# EAGLE design OpenDTU_USB (EAGLE 9.6.2)
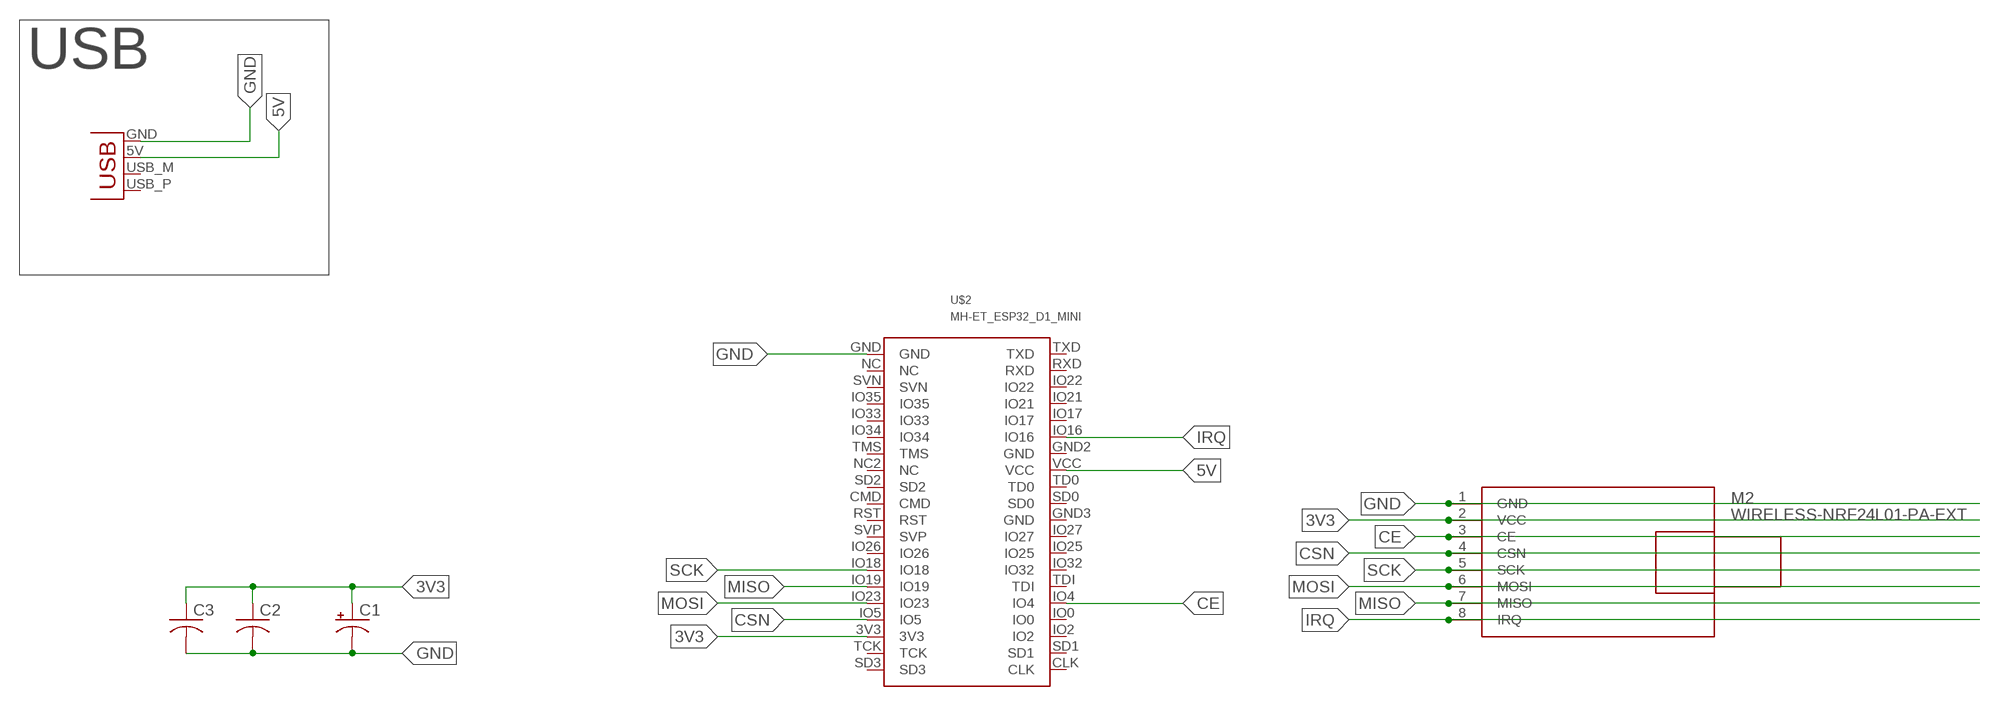
[diagram p0: schematic, sheet 1]

## Parts
C1  CPOL-USE2.5-6  [E2,5-6]
C2  C-USC0805K  [C0805K]
C3  C-USC0805K  [C0805K]
M2  WIRELESS-NRF24L01-PA-EXT  [WIRELESS-NRF24L01-PA-EXT]
U$2  MH-ET_ESP32_D1_MINI  [MH-ET_ESP32_D1_MINI]
X1  USBPCB  [USB-A-PCB]

## Nets
3V3: C1.+ C2.1 C3.1 M2.2(VCC) U$2.3V3
5V: U$2.VCC X1.5V(VBUS)
CE: M2.3(CE) U$2.IO4
CSN: M2.4(CSN) U$2.IO5
GND: C1.- C2.2 C3.2 M2.1(GND) U$2.GND X1.GND
IRQ: M2.8(IRQ) U$2.IO16
MISO: M2.7(MISO) U$2.IO19
MOSI: M2.6(MOSI) U$2.IO23
SCK: M2.5(SCK) U$2.IO18
Unconnected: U$2.CLK U$2.CMD U$2.GND2(GND) U$2.GND3(GND) U$2.IO0 U$2.IO2 U$2.IO17 U$2.IO21 U$2.IO22 U$2.IO25 U$2.IO26 U$2.IO27 U$2.IO32 U$2.IO33 U$2.IO34 U$2.IO35 U$2.NC U$2.NC2(NC) U$2.RST U$2.RXD U$2.SD0 U$2.SD1 U$2.SD2 U$2.SD3 U$2.SVN U$2.SVP U$2.TCK U$2.TD0 U$2.TDI U$2.TMS U$2.TXD X1.USB_M(D-) X1.USB_P(D+)

## Notes on the sheet
- USB

## Library data of the parts
C1 = adafruit:CPOL-US: POLARIZED CAPACITOR, American symbol
C2 C3 = adafruit:C-US: CAPACITOR, American symbol
M2 = diy-modules:WIRELESS-NRF24L01-PA-EXT: 2.4 GHz Wireless Module based on NRF24L01 chip with preamplifier and external antenna Click here to find device on ebay.com <http://www.ebay.com/sch/nrf24l01+pa+lna+sma>
U$2 = MH-ET_ESP32_D1_MINI:MH-ET_ESP32_D1_MINI
X1 = SparkFun_Old:USB: USB Connectors USB-B-PTH is fully proven SKU : PRT-00139 USB-miniB is fully proven SKU : PRT-00587 USB-A-PCB is untested. USB-A-H is throughly reviewed, but untested. Spark Fun Electronics SKU : PRT-00437 USB-B-SMT is throughly reviewed, but untested. Needs silkscreen touching up. USB-A-S has not been used/tested USB-MB-H has not been used/tested

## Board
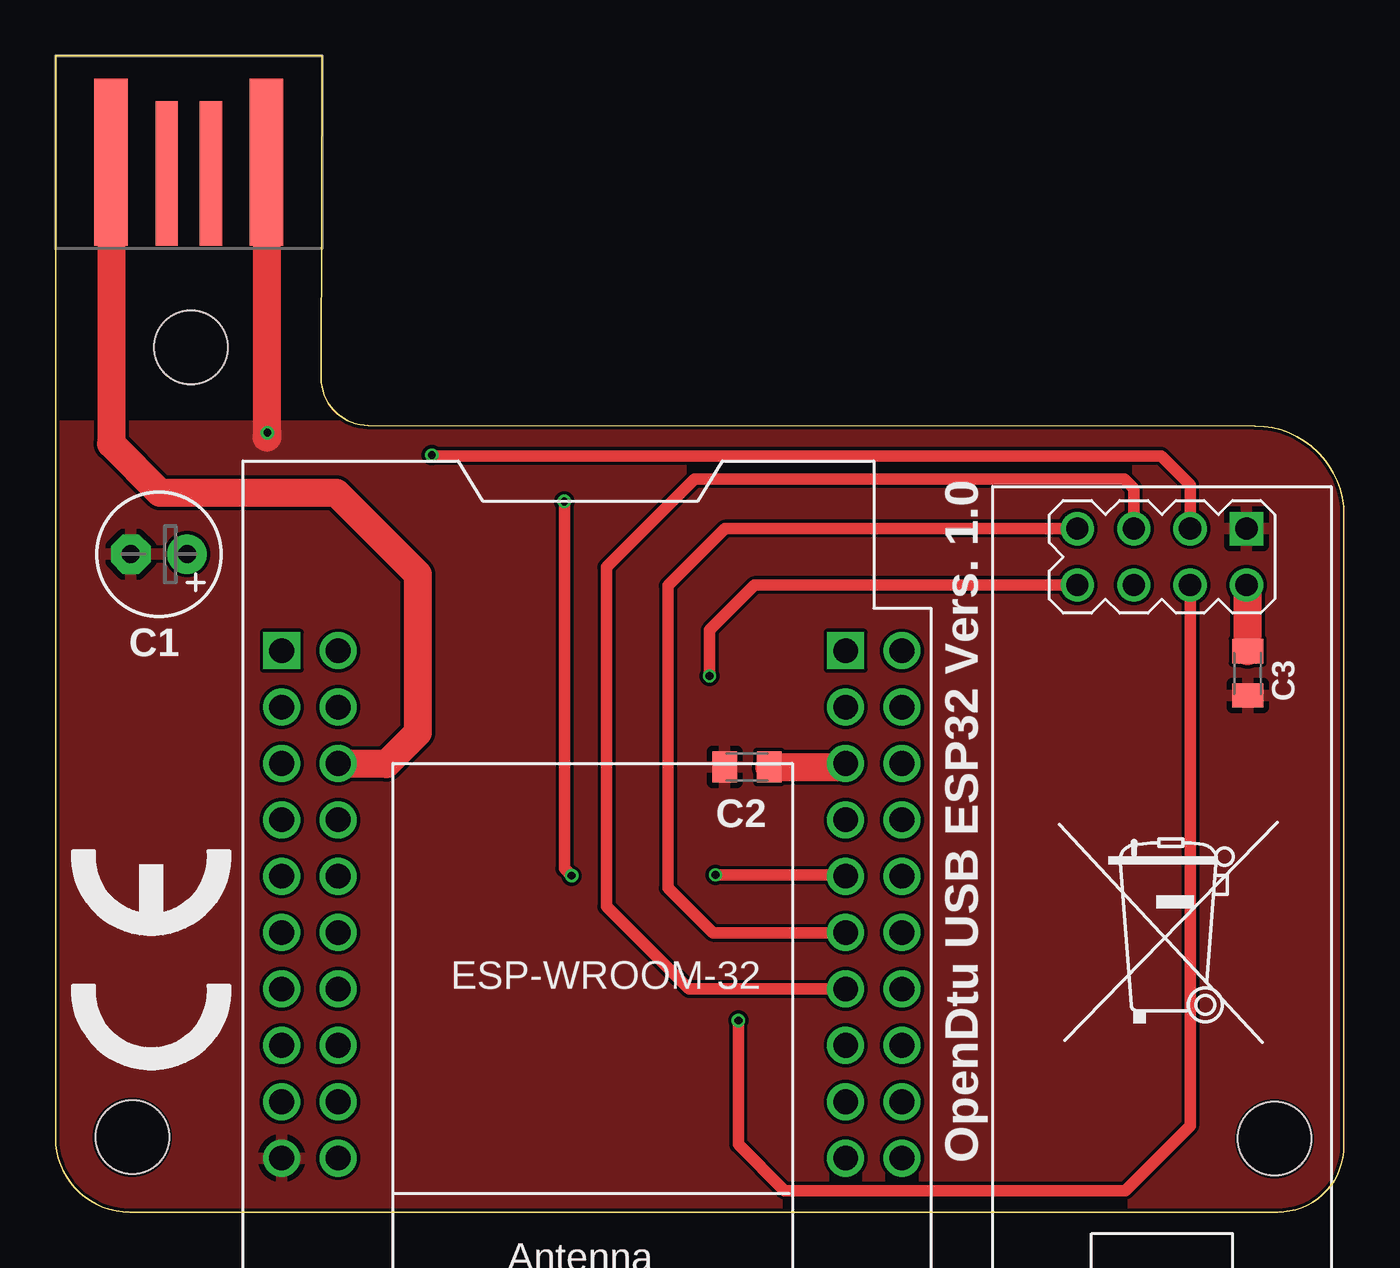
[diagram p1: board, top side]
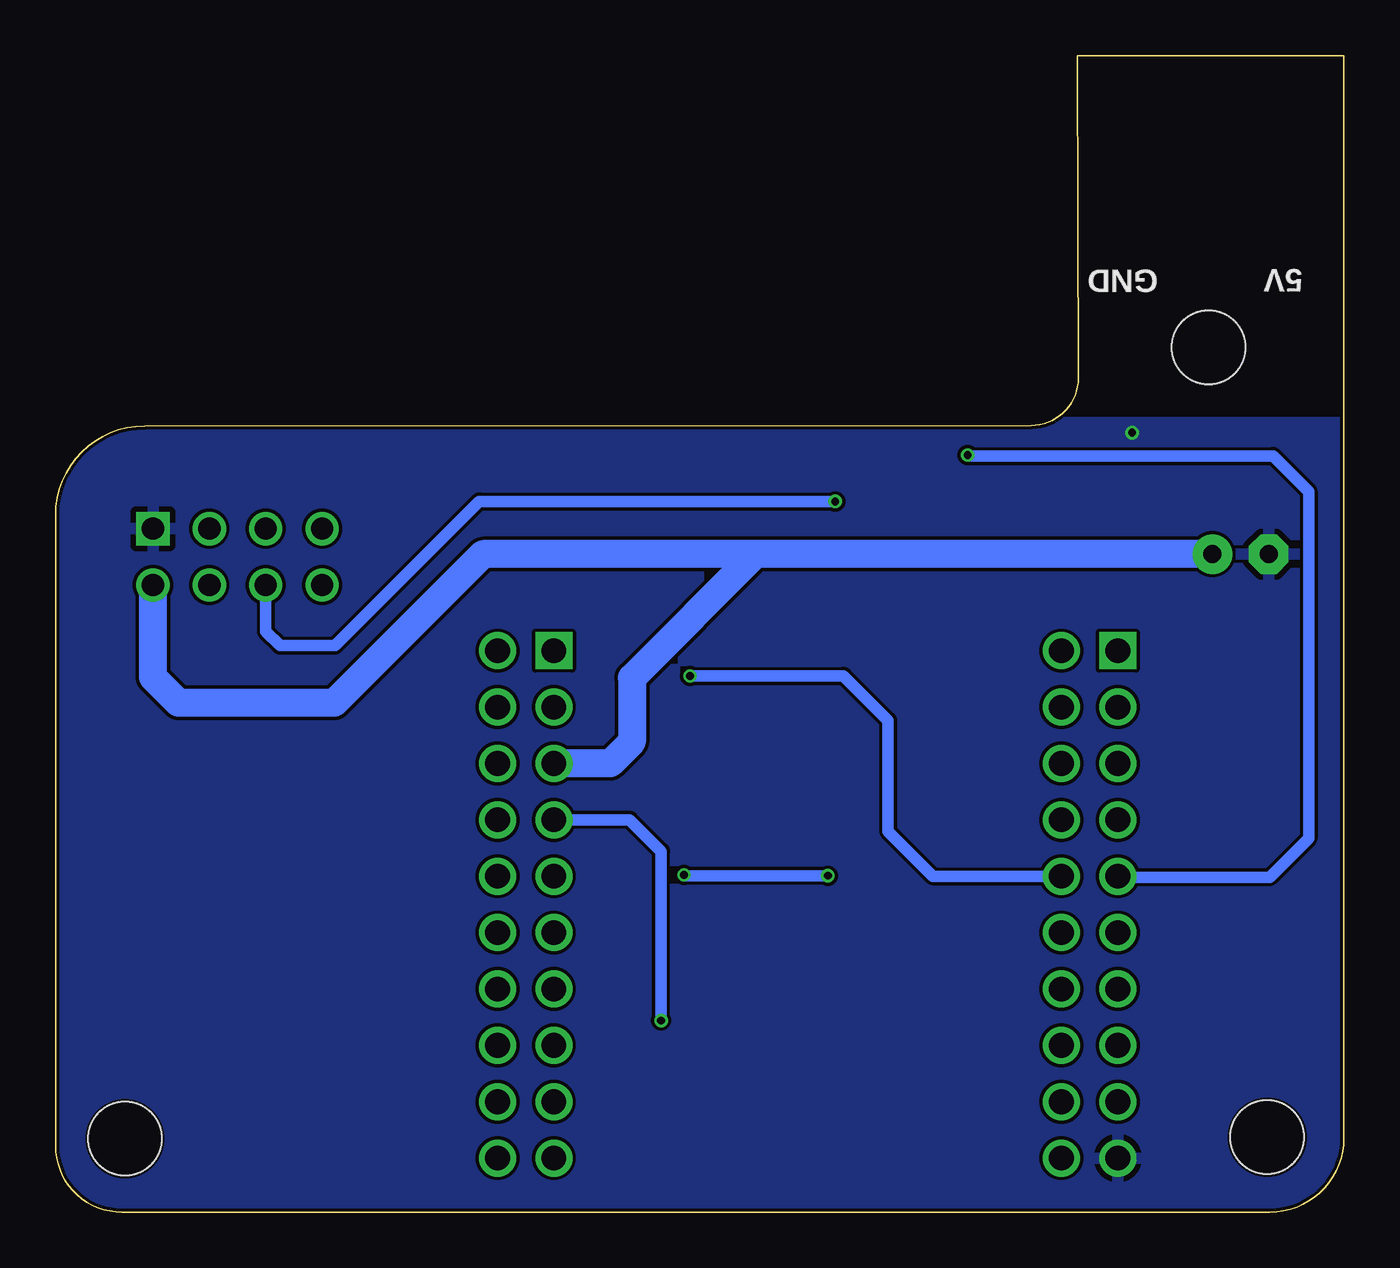
[diagram p2: board, bottom side, seen from below]

Size 58.04 x 52.1 mm. Coordinates in mm from the lower left corner, seen from the top.
Outline: 0,52.1 0,3.34 arc90 3.34,0 55.05,0 arc90 58.04,2.99 58.04,31.4 arc90 54.03,35.41 14.09,35.44 arc-90 11.97,37.57 12.02,52.1 0,52.1
Copper layers (1*16): Top 0.035559375mm / dielectric 1.6mm / Bottom 0.035559375mm
Design rules "oshpark-2layer *": minimum track width 6mil, minimum drill 10mil, track to track 6mil, track to pad 6mil, pad to pad 6mil, via to via 6mil, smd to smd 6mil, copper to edge 5mil, drill to drill 6mil, minimum pad ring 5mil, minimum via ring 5mil, stop-mask expansion 2.5mil, vias tented up to drill 0mil, thermal gap 10mil
Holes 3.3 mm at 6.09,38.96 3.46,3.37 54.91,3.31

### Footprints (pad centres in the part's own frame; a part is rotated, then mirrored left to right if it is on the bottom)
E2,5-6 = drill 0.813 pad 1.778: + -1.27,0 | drill 0.813 pad 1.778 octagon: - 1.27,0
C0805K = smd 1.1 x 1.4: 1 -1,0; 2 1,0
WIRELESS-NRF24L01-PA-EXT = drill 1 square: 1 -18.415,3.81 | drill 1: 2 -15.875,3.81; 3 -18.415,1.27; 4 -15.875,1.27; 5 -18.415,-1.27; 6 -15.875,-1.27; 7 -18.415,-3.81; 8 -15.875,-3.81
MH-ET_ESP32_D1_MINI = drill 1.11 pad 1.665: 3V3 25.4,-5.08; CMD 27.94,0; GND 0,-22.86; GND2 2.54,-7.62; GND3 27.94,-22.86; IO0 0,-7.62; IO2 0,-5.08; IO4 0,-10.16; IO5 25.4,-7.62; IO16 2.54,-10.16; IO17 2.54,-12.7; IO18 25.4,-15.24; IO19 25.4,-12.7; IO21 2.54,-15.24; IO22 2.54,-17.78; IO23 25.4,-10.16; IO25 0,-17.78; IO26 25.4,-17.78; IO27 0,-20.32; IO32 0,-15.24; IO33 27.94,-12.7; IO34 27.94,-10.16; IO35 27.94,-15.24; NC 27.94,-20.32; NC2 27.94,-5.08; RST 25.4,-22.86; RXD 2.54,-20.32; SD0 2.54,0; SD1 0,-2.54; SD2 27.94,-2.54; SVN 27.94,-17.78; SVP 25.4,-20.32; TCK 25.4,-2.54; TD0 2.54,-2.54; TDI 0,-12.7; TMS 27.94,-7.62; TXD 2.54,-22.86; VCC 2.54,-5.08 | drill 1.11 pad 1.665 square: CLK 0,0; SD3 25.4,0
USB-A-PCB = smd 7.5 x 1.5: 5V -0.2,-3.5; GND -0.2,3.5 | smd 6.5 x 1: USB_M 0.3,-1; USB_P 0.3,1

### Placement (x,y rotation side)
C1  4.66,29.64 180 top
C2  31.14,20.05 180 top
C3  53.7,24.27 270 top
M2  49.84,12.37 270 top
U$1  [CE_7.3MM]  7.95,6.33 90 top
U$2  10.19,25.29 0 top
U$3  [MUELLTONNE_10.00]  44.55,7.24 0 top
X1  6,47.1 270 top

### Tracks (layer width: path | path; a pad name or v marks a point on that pad's centre or on a via)
3V3
  Top 1.27: C2.1 35.43,20.05 U$2.3V3 | C3.1 53.7,28.19 M2.2
  Bottom 1.27: C1.+ 26.51,29.64 | 26.51,29.64 32.08,24.07 32.08,21.18 33.05,20.21 U$2.3V3 | 26.51,29.64 38.78,29.64 45.48,22.94 52.5,22.94 53.65,24.09 M2.2
5V
  Top 1.27: X1.5V 2.5,34.61 4.7,32.41 12.65,32.41 16.32,28.74 16.32,21.59 14.91,20.18 12.76,20.18 U$2.VCC
CE  (via drill 0.35)
  Top 0.508: M2.3 51.11,32.76 49.81,34.06 16.99,34.06 v16.95,34.1
  Bottom 0.508: v16.95,34.1 16.91,34.06 3.19,34.06 1.59,32.46 1.59,16.84 3.35,15.08 10.14,15.08 U$2.IO4
CSN  (via drill 0.35)
  Top 0.508: M2.4 51.11,3.88 48.2,0.97 32.84,0.97 30.76,3.05 v30.76,8.63
  Bottom 0.508: v30.76,8.63 30.76,16.25 32.18,17.67 U$2.IO5
GND  (via drill 0.35)
  Top 1.27: X1.GND 9.5,34.89 9.55,34.89 v9.55,35.11
  pour Top: 13.99,35.41 0.07,35.41 0.07,0.29 57.99,0.29 57.99,35.45 13.99,35.45
  pour Bottom: 0.15,35.57 58.2,35.57 58.2,0.14 0.15,0.14
IRQ  (via drill 0.35)
  Top 0.508: M2.8 31.48,28.25 29.46,26.22 v29.46,24.15
  Bottom 0.508: v29.46,24.15 22.54,24.15 20.54,22.15 20.54,17.15 18.52,15.13 U$2.IO16
MISO
  Top 0.508: M2.7 30.16,30.79 27.59,28.22 27.59,14.6 29.61,12.58 U$2.IO19
MOSI  (via drill 0.35)
  Top 0.508: v22.92,32.01 22.92,15.48 v23.25,15.15 | v29.73,15.19 35.53,15.19 U$2.IO23
  Bottom 0.508: M2.6 48.57,26.16 47.93,25.52 45.45,25.52 38.96,32.01 v22.92,32.01 | v23.25,15.15 29.69,15.15 v29.73,15.19
SCK
  Top 0.508: M2.5 48.57,32.59 48.14,33.02 28.79,33.02 24.82,29.05 24.82,13.77 28.54,10.05 U$2.IO18

### Text on the board
tNames: OpenDtu USB ESP32 Vers. 1.0
bNames: 5V | GND